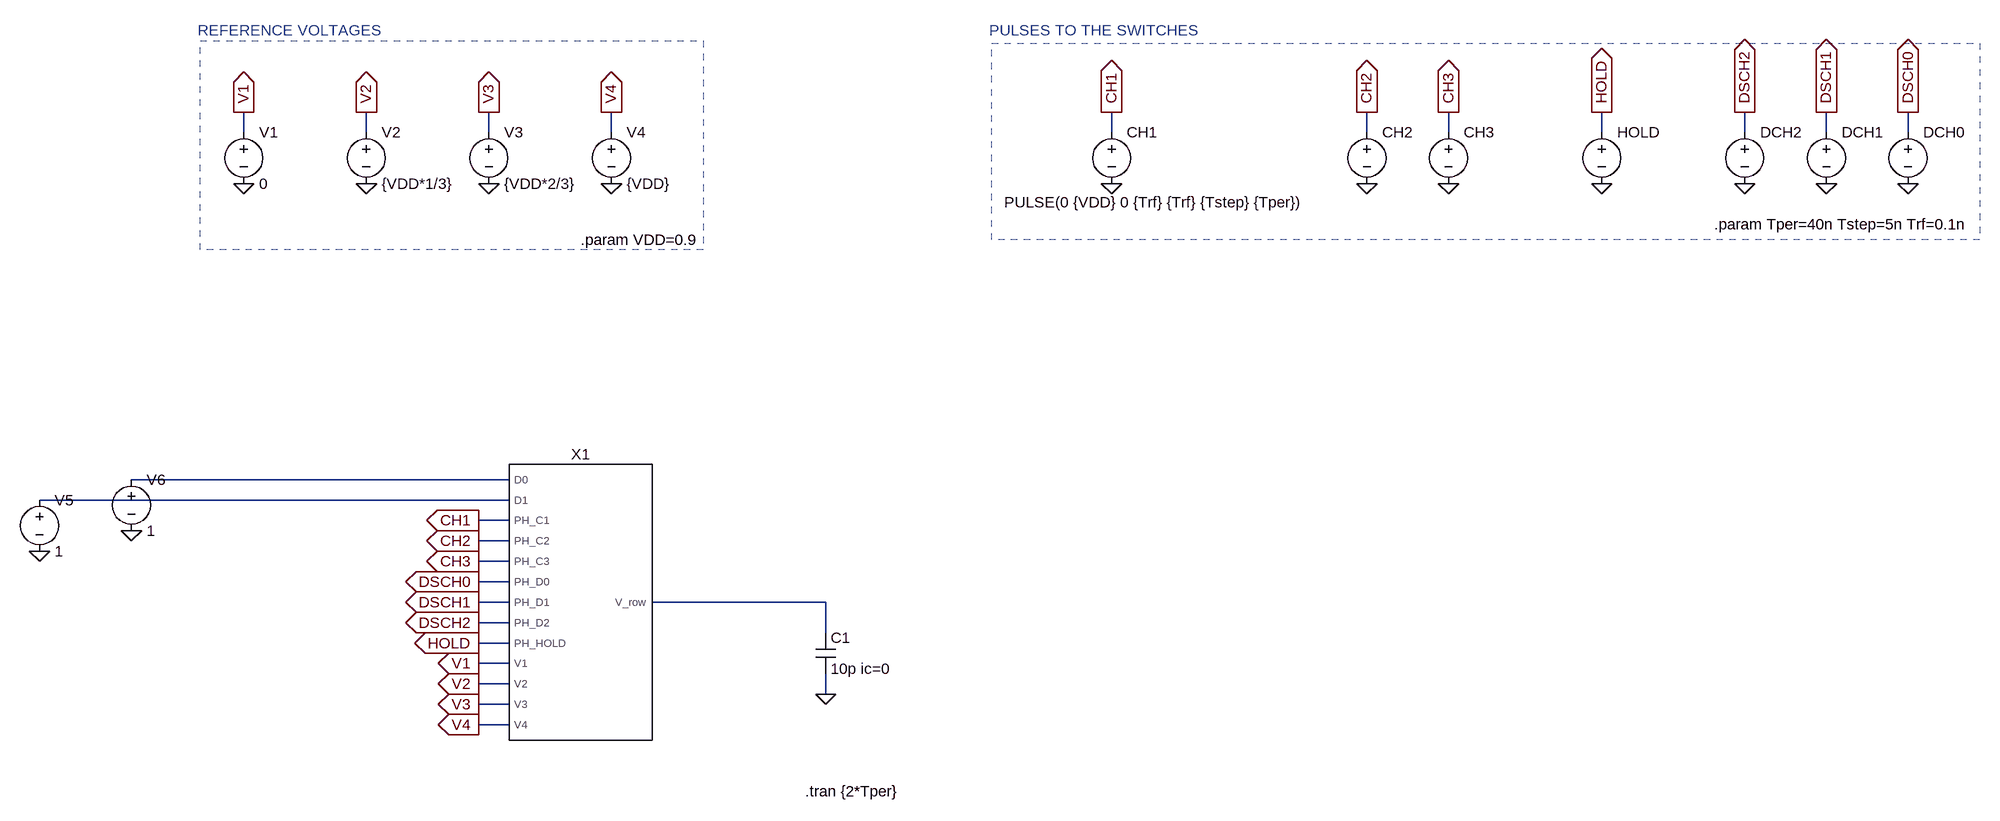
[diagram p0: schematic DAC.asc]
DAC.asc, the LTspice schematic file:
Version 4
SHEET 1 3396 1632
WIRE 32 416 32 384
WIRE 224 416 224 384
WIRE 416 416 416 384
WIRE 608 416 608 384
WIRE 1392 416 1392 384
WIRE 1792 416 1792 384
WIRE 1920 416 1920 384
WIRE 2160 416 2160 384
WIRE 2384 416 2384 384
WIRE 2512 416 2512 384
WIRE 2640 416 2640 384
WIRE 448 960 -144 960
WIRE 448 992 -288 992
WIRE 448 1024 400 1024
WIRE 448 1056 400 1056
WIRE 448 1088 400 1088
WIRE 448 1120 400 1120
WIRE 448 1152 400 1152
WIRE 944 1152 672 1152
WIRE 448 1184 400 1184
WIRE 944 1200 944 1152
WIRE 448 1216 400 1216
WIRE 448 1248 400 1248
WIRE 448 1280 400 1280
WIRE 944 1296 944 1264
WIRE 448 1312 400 1312
WIRE 448 1344 400 1344
FLAG 32 496 0
FLAG 224 496 0
FLAG 416 496 0
FLAG 608 496 0
FLAG 32 384 V1
IOPIN 32 384 Out
FLAG 224 384 V2
IOPIN 224 384 Out
FLAG 416 384 V3
IOPIN 416 384 Out
FLAG 608 384 V4
IOPIN 608 384 Out
FLAG 1392 496 0
FLAG 1792 496 0
FLAG 1920 496 0
FLAG 2160 496 0
FLAG 2640 496 0
FLAG 2512 496 0
FLAG 2384 496 0
FLAG 1392 384 CH1
IOPIN 1392 384 Out
FLAG 1792 384 CH2
IOPIN 1792 384 Out
FLAG 1920 384 CH3
IOPIN 1920 384 Out
FLAG 2160 384 HOLD
IOPIN 2160 384 Out
FLAG 2384 384 DSCH2
IOPIN 2384 384 Out
FLAG 2512 384 DSCH1
IOPIN 2512 384 Out
FLAG 2640 384 DSCH0
IOPIN 2640 384 Out
FLAG 944 1296 0
FLAG 400 1344 V4
IOPIN 400 1344 Out
FLAG 400 1312 V3
IOPIN 400 1312 Out
FLAG 400 1280 V2
IOPIN 400 1280 Out
FLAG 400 1248 V1
IOPIN 400 1248 Out
FLAG 400 1024 CH1
IOPIN 400 1024 Out
FLAG 400 1056 CH2
IOPIN 400 1056 Out
FLAG 400 1088 CH3
IOPIN 400 1088 Out
FLAG 400 1216 HOLD
IOPIN 400 1216 Out
FLAG 400 1184 DSCH2
IOPIN 400 1184 Out
FLAG 400 1152 DSCH1
IOPIN 400 1152 Out
FLAG 400 1120 DSCH0
IOPIN 400 1120 Out
FLAG -144 1040 0
FLAG -288 1072 0
SYMBOL Voltage 32 400 R0
SYMATTR InstName V1
SYMATTR Value 0
SYMBOL Voltage 224 400 R0
SYMATTR InstName V2
SYMATTR Value {VDD*1/3}
SYMBOL Voltage 416 400 R0
SYMATTR InstName V3
SYMATTR Value {VDD*2/3}
SYMBOL Voltage 608 400 R0
SYMATTR InstName V4
SYMATTR Value {VDD}
SYMBOL Voltage 1392 400 R0
WINDOW 3 -168 125 Left 2
SYMATTR Value PULSE(0 {VDD} 0 {Trf} {Trf} {Tstep} {Tper})
SYMATTR InstName CH1
SYMBOL Voltage 1792 400 R0
WINDOW 3 24 96 Invisible 2
SYMATTR Value PULSE(0 {VDD} {Tstep} {Trf} {Trf} {Tstep} {Tper})
SYMATTR InstName CH2
SYMBOL Voltage 1920 400 R0
WINDOW 3 24 96 Invisible 2
SYMATTR Value PULSE(0 {VDD} {2*Tstep} {Trf} {Trf} {Tstep} {Tper})
SYMATTR InstName CH3
SYMBOL Voltage 2160 400 R0
WINDOW 3 24 96 Invisible 2
SYMATTR Value PULSE(0 {VDD} {3*Tstep} {Trf} {Trf} {Tstep} {Tper})
SYMATTR InstName HOLD
SYMBOL Voltage 2640 400 R0
WINDOW 3 24 96 Invisible 2
SYMATTR Value PULSE(0 {VDD} {6*Tstep} {Trf} {Trf} {Tstep} {Tper})
SYMATTR InstName DCH0
SYMBOL Voltage 2512 400 R0
WINDOW 3 24 96 Invisible 2
SYMATTR Value PULSE(0 {VDD} {5*Tstep} {Trf} {Trf} {Tstep} {Tper})
SYMATTR InstName DCH1
SYMBOL Voltage 2384 400 R0
WINDOW 3 24 96 Invisible 2
SYMATTR Value PULSE(0 {VDD} {4*Tstep} {Trf} {Trf} {Tstep} {Tper})
SYMATTR InstName DCH2
SYMBOL Cap 928 1200 R0
SYMATTR InstName C1
SYMATTR Value 10p ic=0
SYMBOL Stepwise_driver 560 1152 R0
SYMATTR InstName X1
SYMBOL Voltage -288 976 R0
SYMATTR InstName V5
SYMATTR Value 1
SYMBOL Voltage -144 944 R0
SYMATTR InstName V6
SYMATTR Value 1
TEXT -40 256 Left 2 ;REFERENCE VOLTAGES
TEXT 560 584 Left 2 !.param VDD=0.9
TEXT 2336 560 Left 2 !.param Tper=40n Tstep=5n Trf=0.1n
TEXT 1200 256 Left 2 ;PULSES TO THE SWITCHES
TEXT 912 1448 Left 2 !.tran {2*Tper}
RECTANGLE Normal -36 272 752 600 2
RECTANGLE Normal 1204 276 2752 584 2

The netlist it stands for:
* DAC.asc
V1 V1 0 0
V2 V2 0 {VDD*1/3}
V3 V3 0 {VDD*2/3}
V4 V4 0 {VDD}
V§CH1 CH1 0 PULSE(0 {VDD} 0 {Trf} {Trf} {Tstep} {Tper})
V§CH2 CH2 0 PULSE(0 {VDD} {Tstep} {Trf} {Trf} {Tstep} {Tper})
V§CH3 CH3 0 PULSE(0 {VDD} {2*Tstep} {Trf} {Trf} {Tstep} {Tper})
V§HOLD HOLD 0 PULSE(0 {VDD} {3*Tstep} {Trf} {Trf} {Tstep} {Tper})
V§DCH0 DSCH0 0 PULSE(0 {VDD} {6*Tstep} {Trf} {Trf} {Tstep} {Tper})
V§DCH1 DSCH1 0 PULSE(0 {VDD} {5*Tstep} {Trf} {Trf} {Tstep} {Tper})
V§DCH2 DSCH2 0 PULSE(0 {VDD} {4*Tstep} {Trf} {Trf} {Tstep} {Tper})
C1 N003 0 10p ic=0
XX1 N001 N002 CH1 CH2 CH3 DSCH0 DSCH1 DSCH2 HOLD V1 V2 V3 V4 N003 Stepwise_driver  ; pins D0 D1 PH_C1 PH_C2 PH_C3 PH_D0 PH_D1 PH_D2 PH_HOLD V1 V2 V3 V4 V_row
V5 N002 0 1
V6 N001 0 1
* REFERENCE VOLTAGES
.param VDD=0.9
.param Tper=40n Tstep=5n Trf=0.1n
* PULSES TO THE SWITCHES
.tran {2*Tper}
.backanno
.end